# EAGLE design Brain (EAGLE 5.11)
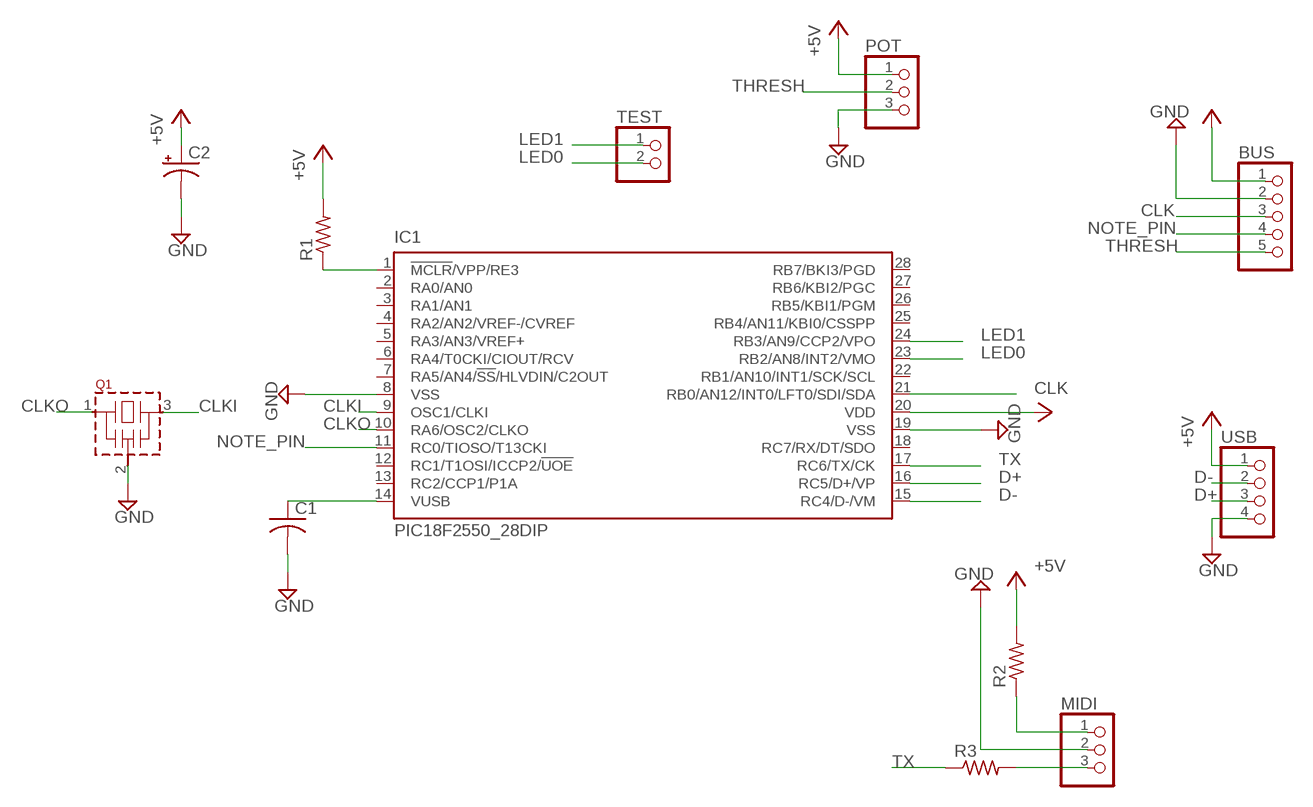
[diagram p0: schematic, sheet 1]

## Parts
BUS  PINHD-1X5  [1X05]
C1  C-US025-025X050  [C025-025X050]
C2  CPOL-USE3.5-8  [E3,5-8]
IC1  PIC18F2550_28DIP  [DIL28-3]
MIDI  PINHD-1X3  [1X03]
POT  PINHD-1X3  [1X03]
Q1  CSTLS_X  [CSTLS_X]
R1  R-US_0207/10  [0207/10]
R2  R-US_0207/10  [0207/10]
R3  R-US_0207/10  [0207/10]
TEST  PINHD-1X2  [1X02]
USB  PINHD-1X4  [1X04]

## Nets
+5V: BUS.1 C2.+ IC1.20(VDD) POT.1 R1.2 R2.2 USB.1
CLK: BUS.3 IC1.21(RB0/AN12/INT0/LFT0/SDI/SDA)
CLKI: IC1.9(OSC1/CLKI) Q1.3
CLKO: IC1.10(RA6/OSC2/CLKO) Q1.1
D+: IC1.16(RC5/D+/VP) USB.3
D-: IC1.15(RC4/D-/VM) USB.2
GND: BUS.2 C1.2 C2.- IC1.8(VSS) IC1.19(VSS) MIDI.2 POT.3 Q1.2(VSS) USB.4
LED0: IC1.23(RB2/AN8/INT2/VMO) TEST.2
LED1: IC1.24(RB3/AN9/CCP2/VPO) TEST.1
N$1: C1.1 IC1.14(VUSB)
N$2: IC1.1(!MCLR!/VPP/RE3) R1.1
N$3: MIDI.1 R2.1
N$4: MIDI.3 R3.2
NOTE_PIN: BUS.4 IC1.11(RC0/TIOSO/T13CKI)
THRESH: BUS.5 POT.2
TX: IC1.17(RC6/TX/CK) R3.1
Unconnected: IC1.2(RA0/AN0) IC1.3(RA1/AN1) IC1.4(RA2/AN2/VREF-/CVREF) IC1.5(RA3/AN3/VREF+) IC1.6(RA4/T0CKI/CIOUT/RCV) IC1.7(RA5/AN4/!SS!/HLVDIN/C2OUT) IC1.12(RC1/T1OSI/ICCP2/!UOE) IC1.13(RC2/CCP1/P1A) IC1.18(RC7/RX/DT/SDO) IC1.22(RB1/AN10/INT1/SCK/SCL) IC1.25(RB4/AN11/KBI0/CSSPP) IC1.26(RB5/KBI1/PGM) IC1.27(RB6/KBI2/PGC) IC1.28(RB7/BKI3/PGD)

## Library data of the parts
BUS = pinhead:PINHD-1X5: PIN HEADER
C1 = rcl:C-US: CAPACITOR, American symbol
C2 = rcl:CPOL-US: POLARIZED CAPACITOR, American symbol
IC1 = microchip:PIC18F2*_28: USB Microcontrollers with nanoWatt Technology High-Performance, Enhanced Flash, 28/40/44-Pin, Source: http://ww1.microchip.com/downloads/en/devicedoc/39632c.pdf; MF: MICROCHIP; MPN: PIC18F2550-I/SP; OC_FARNELL: 1523822; OC_NEWARK: 80K6054
MIDI POT = pinhead:PINHD-1X3: PIN HEADER
Q1 = murata-resonators:CSTLS_X: Ceramic resonator 16.00 to 70.00 MHz
R1-R3 = rcl:R-US_: RESISTOR, American symbol
TEST = pinhead:PINHD-1X2: PIN HEADER
USB = pinhead:PINHD-1X4: PIN HEADER

## Board
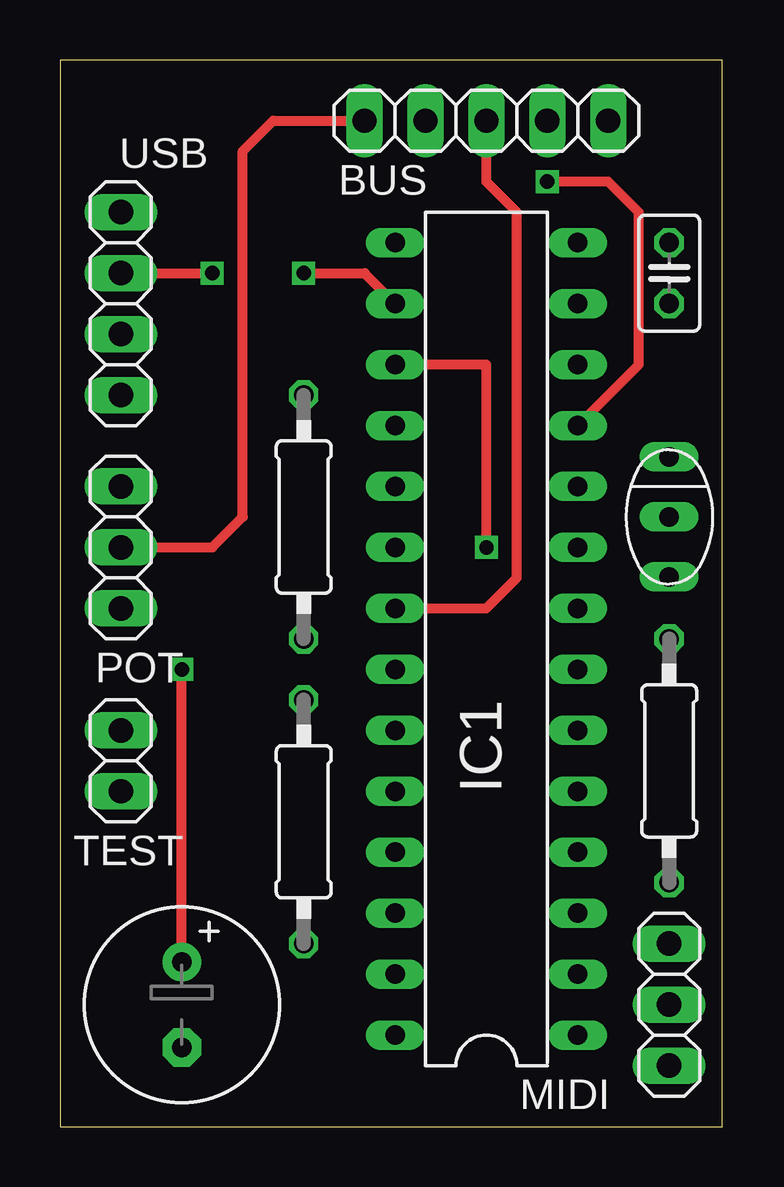
[diagram p1: board, top side]
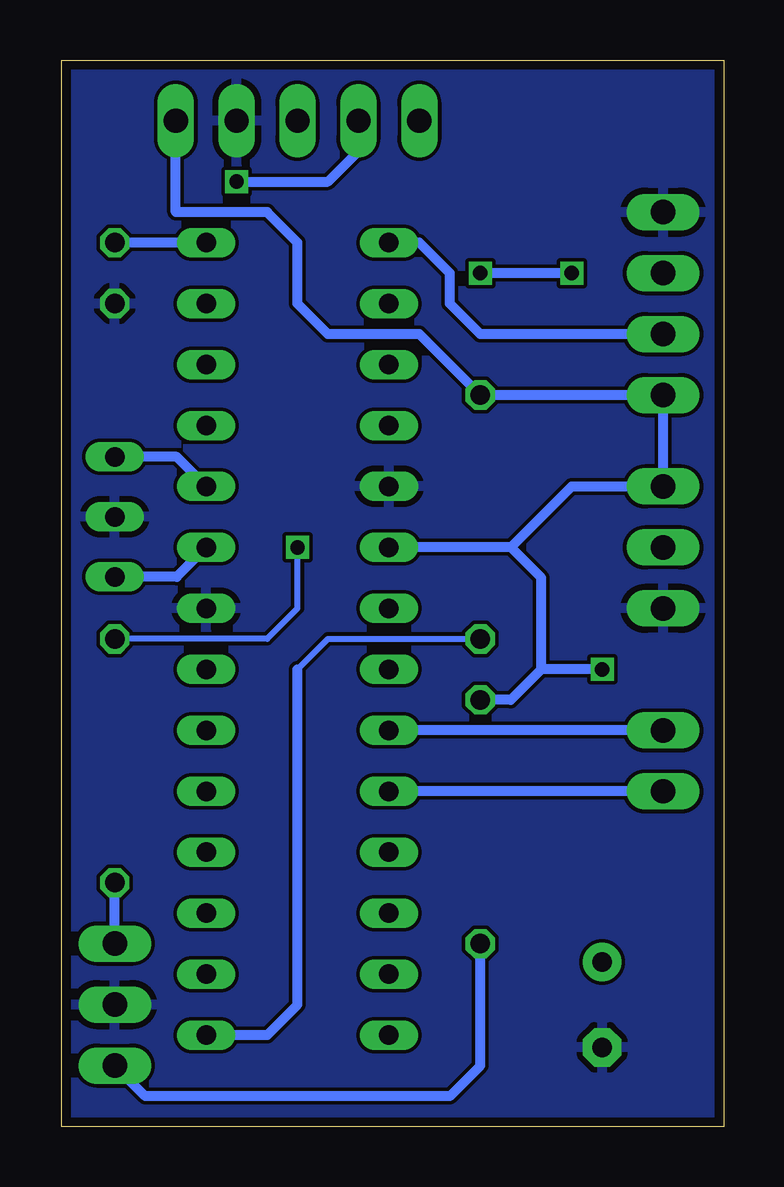
[diagram p2: board, bottom side, seen from below]

Size 27.61 x 44.44 mm. Coordinates in mm from the lower left corner, seen from the top.
Outline: 0,0 27.61,0 27.61,44.44 0,44.44 0,0
Copper layers (1*16): Top 0.0356mm / dielectric 1.5011mm / Bottom 0.0356mm
Design rules "LaenPCBOrder": minimum track width 6mil, minimum drill 13mil, track to track 6mil, track to pad 6mil, pad to pad 6mil, via to via 6mil, smd to smd 6mil, copper to edge 15mil, drill to drill 6mil, minimum pad ring 7mil, minimum via ring 7mil, stop-mask expansion 4mil, vias tented up to drill 0mil, thermal gap 10mil

### Footprints (pad centres in the part's own frame; a part is rotated, then mirrored left to right if it is on the bottom)
1X05 = drill 1.016 long: 1 -5.08,0; 2 -2.54,0; 3 0,0; 4 2.54,0; 5 5.08,0
C025-025X050 = drill 0.813 octagon: 1 -1.27,0; 2 1.27,0
E3,5-8 = drill 0.813 pad 1.6 round: + -1.778,0 | drill 0.813 pad 1.6 octagon: - 1.778,0
DIL28-3 = drill 0.813 long: 1 -16.51,-3.81; 2 -13.97,-3.81; 3 -11.43,-3.81; 4 -8.89,-3.81; 5 -6.35,-3.81; 6 -3.81,-3.81; 7 -1.27,-3.81; 8 1.27,-3.81; 9 3.81,-3.81; 10 6.35,-3.81; 11 8.89,-3.81; 12 11.43,-3.81; 13 13.97,-3.81; 14 16.51,-3.81; 15 16.51,3.81; 16 13.97,3.81; 17 11.43,3.81; 18 8.89,3.81; 19 6.35,3.81; 20 3.81,3.81; 21 1.27,3.81; 22 -1.27,3.81; 23 -3.81,3.81; 24 -6.35,3.81; 25 -8.89,3.81; 26 -11.43,3.81; 27 -13.97,3.81; 28 -16.51,3.81
1X03 = drill 1.016 long: 1 -2.54,0; 2 0,0; 3 2.54,0
CSTLS_X = drill 0.813 long: 1 -2.5,0; 2 0,0; 3 2.5,0
0207/10 = drill 0.813 octagon: 1 -5.08,0; 2 5.08,0
1X02 = drill 1.016 long: 1 -1.27,0; 2 1.27,0
1X04 = drill 1.016 long: 1 -3.81,0; 2 -1.27,0; 3 1.27,0; 4 3.81,0

### Placement (x,y rotation side)
BUS  17.78,41.91 180 top
C1  25.4,35.56 270 top
C2  5.08,5.08 270 top
IC1  17.78,20.32 90 top
MIDI  25.4,5.08 90 top
POT  2.54,24.13 270 top
Q1  25.4,25.4 270 top
R1  10.16,25.4 90 top
R2  10.16,12.7 90 top
R3  25.4,15.24 270 top
TEST  2.54,15.24 90 top
USB  2.54,34.29 90 top

### Tracks (layer width: path | path; a pad name or v marks a point on that pad's centre or on a via)
+5V  (via drill 0.6)
  Top 0.406: C2.+ v5.08,19.05
  Bottom 0.406: R2.2 8.89,17.78 7.62,19.05 | 7.62,19.05 7.62,22.86 8.89,24.13 | 8.89,24.13 IC1.20 | 8.89,24.13 6.35,26.67 POT.1 USB.1 R1.2 12.7,33.02 16.51,33.02 17.78,34.29 17.78,36.83 19.05,38.1 22.86,38.1 BUS.1 | v5.08,19.05 7.62,19.05
CLK
  Top 0.406: BUS.3 17.78,39.37 19.05,38.1 19.05,22.86 17.78,21.59 IC1.21
CLKI
  Bottom 0.406: Q1.3 22.82,22.9 IC1.9
CLKO
  Bottom 0.406: Q1.1 22.82,27.9 IC1.10
D+  (via drill 0.6)
  Top 0.406: USB.3 v6.35,35.56 | v10.16,35.56 12.7,35.56 IC1.16
  Bottom 0.406: v6.35,35.56 v10.16,35.56
D-
  Bottom 0.406: USB.2 10.16,33.02 11.43,34.29 11.43,35.56 12.7,36.83 IC1.15
GND
  pour Bottom: 0,44.45 27.94,44.45 27.94,0 0,0
LED0
  Bottom 0.406: TEST.2 IC1.23
LED1
  Bottom 0.406: TEST.1 IC1.24
N$1
  Bottom 0.406: IC1.14 C1.1
N$2
  Bottom 0.254: R1.1 16.51,20.32 17.78,19.05
  Bottom 0.406: 17.78,19.05 17.78,5.08 19.05,3.81 IC1.1
N$3
  Bottom 0.406: R2.1 10.16,2.54 11.43,1.27 24.13,1.27 MIDI.1
N$4
  Bottom 0.406: MIDI.3 R3.2
NOTE_PIN  (via drill 0.6)
  Top 0.406: IC1.11 24.13,31.75 24.13,38.1 22.86,39.37 v20.32,39.37
  Bottom 0.406: v20.32,39.37 16.51,39.37 15.24,40.64 BUS.4
THRESH
  Top 0.406: POT.2 6.35,24.13 7.62,25.4 7.62,40.64 8.89,41.91 BUS.5
TX  (via drill 0.6)
  Top 0.406: IC1.17 17.78,31.75 v17.78,24.13
  Bottom 0.254: v17.78,24.13 17.78,21.59 19.05,20.32 R3.1